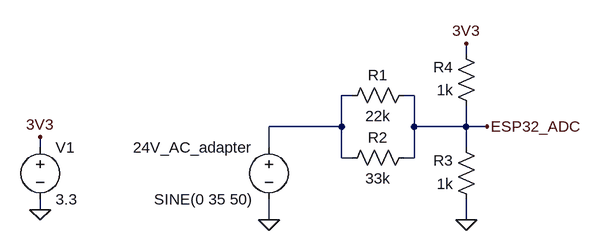
[diagram p0: schematic voltage_probe.asc]
voltage_probe.asc, the LTspice schematic file:
Version 4
SHEET 1 916 680
WIRE 576 -48 576 -64
WIRE 400 16 384 16
WIRE 496 16 480 16
WIRE 384 64 384 16
WIRE 384 64 272 64
WIRE 496 64 496 16
WIRE 576 64 576 32
WIRE 576 64 496 64
WIRE 608 64 576 64
WIRE -80 96 -80 80
WIRE 272 96 272 64
WIRE 576 96 576 64
WIRE 384 112 384 64
WIRE 400 112 384 112
WIRE 496 112 496 64
WIRE 496 112 480 112
WIRE -80 192 -80 176
WIRE 272 208 272 176
WIRE 576 208 576 176
FLAG -80 80 3V3
FLAG 576 -64 3V3
FLAG -80 192 0
FLAG 272 208 0
FLAG 576 208 0
FLAG 608 64 ESP32_ADC
SYMBOL voltage -80 80 R0
WINDOW 123 0 0 Left 0
WINDOW 39 0 0 Left 0
SYMATTR InstName V1
SYMATTR Value 3.3
SYMBOL voltage 272 80 M0
WINDOW 123 0 0 Left 0
WINDOW 39 0 0 Left 0
SYMATTR InstName 24V_AC_adapter
SYMATTR Value SINE(0 35 50)
SYMBOL res 496 0 R90
WINDOW 0 0 56 VBottom 2
WINDOW 3 32 56 VTop 2
SYMATTR InstName R1
SYMATTR Value 22k
SYMBOL res 496 96 R90
WINDOW 0 0 56 VBottom 2
WINDOW 3 32 56 VTop 2
SYMATTR InstName R2
SYMATTR Value 33k
SYMBOL res 592 192 R180
WINDOW 0 36 76 Left 2
WINDOW 3 36 40 Left 2
SYMATTR InstName R3
SYMATTR Value 1k
SYMBOL res 592 48 R180
WINDOW 0 36 76 Left 2
WINDOW 3 36 40 Left 2
SYMATTR InstName R4
SYMATTR Value 1k

The netlist it stands for:
* voltage_probe.asc
V1 3V3 0 3.3
V§24V_AC_adapter N001 0 SINE(0 35 50)
R1 ESP32_ADC N001 22k
R2 ESP32_ADC N001 33k
R3 0 ESP32_ADC 1k
R4 ESP32_ADC 3V3 1k
.backanno
.end